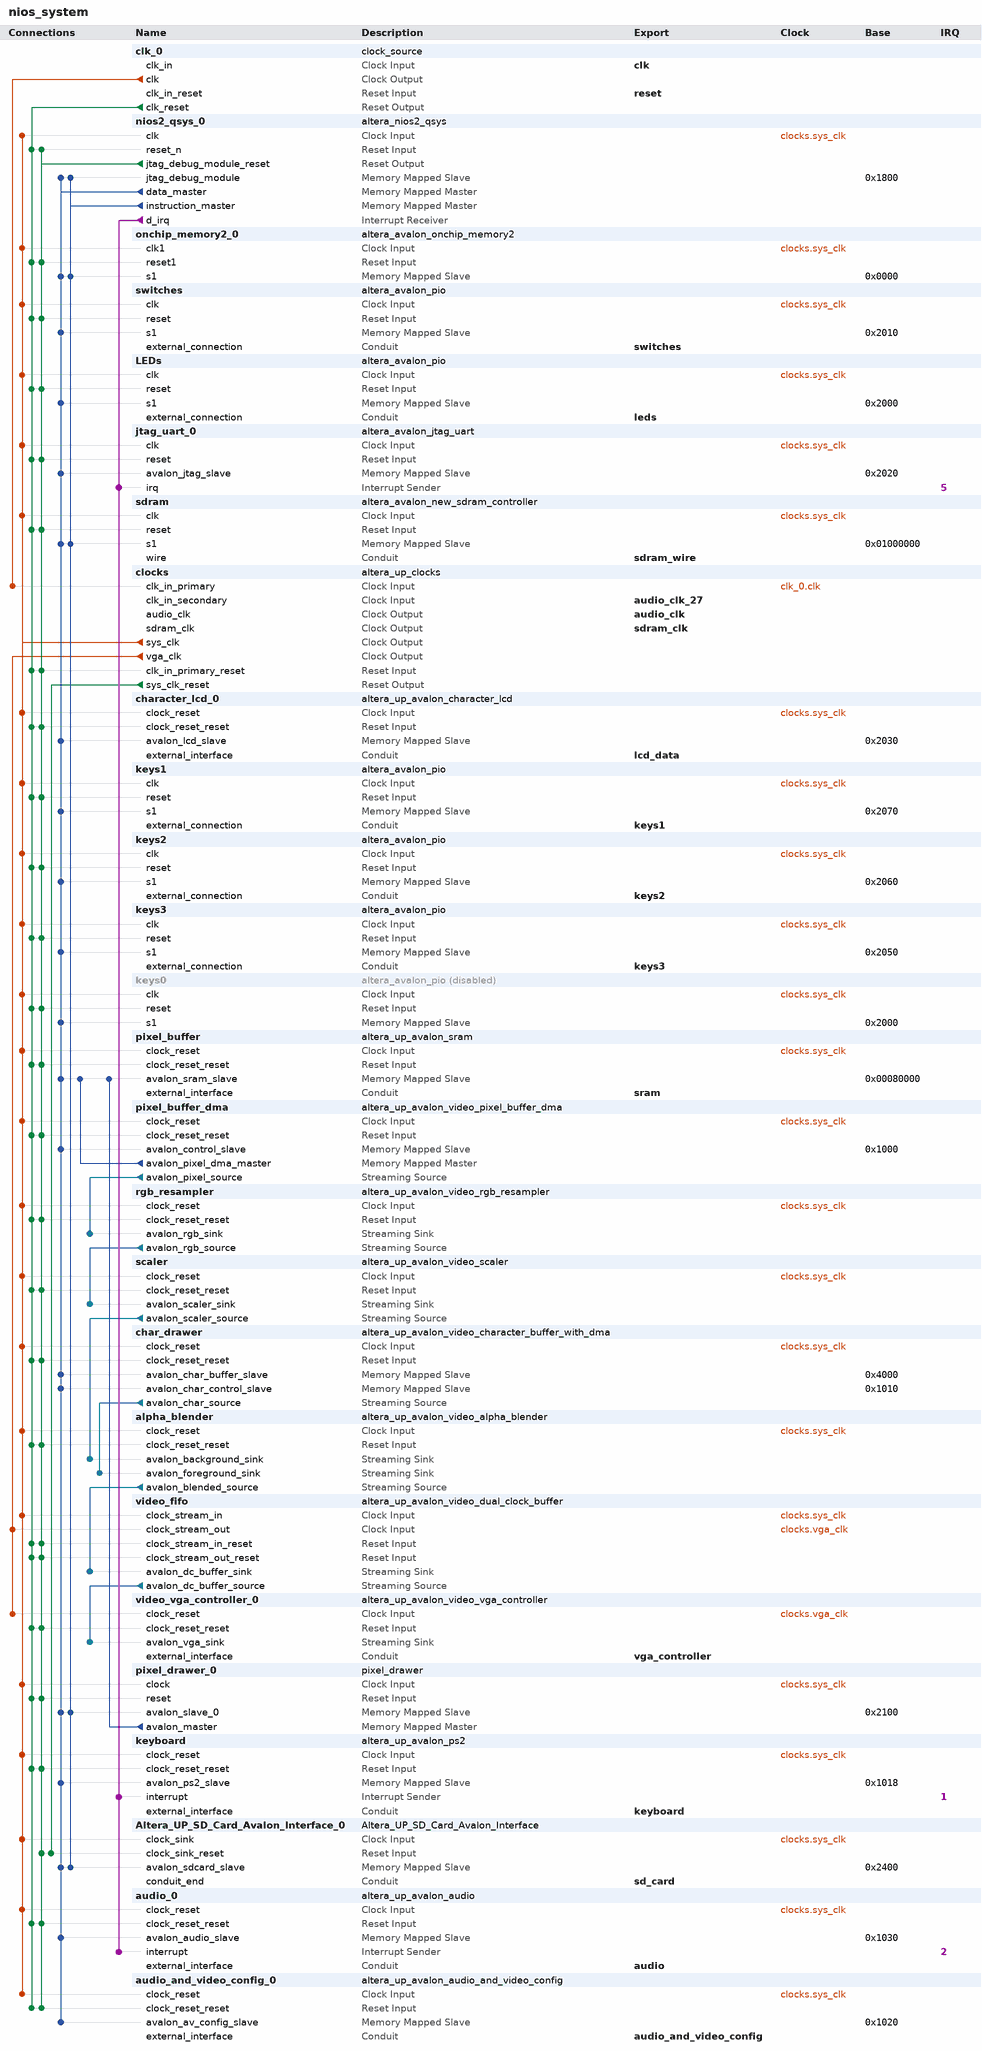
[diagram p0: system contents]
# Platform Designer (Qsys) system nios_system, Cyclone II EP2C35F672C6
# Parameters at their usual value, and those the tool derives, are not listed.
package require -exact qsys 13.0
create_system nios_system
set_project_property DEVICE_FAMILY {Cyclone II}
set_project_property DEVICE EP2C35F672C6

add_instance clk_0 clock_source 13.0
set_instance_parameter_value clk_0 clockFrequency 50000000

add_instance nios2_qsys_0 altera_nios2_qsys 13.0
set_instance_parameter_value nios2_qsys_0 resetSlave sdram.s1
set_instance_parameter_value nios2_qsys_0 mmu_TLBMissExcSlave None
set_instance_parameter_value nios2_qsys_0 exceptionSlave sdram.s1
set_instance_parameter_value nios2_qsys_0 breakSlave nios2_qsys_0.jtag_debug_module
set_instance_parameter_value nios2_qsys_0 impl Fast
set_instance_parameter_value nios2_qsys_0 icache_size 4096

add_instance onchip_memory2_0 altera_avalon_onchip_memory2 13.0.1.99.2
set_instance_parameter_value onchip_memory2_0 dataWidth 32
set_instance_parameter_value onchip_memory2_0 dualPort false
set_instance_parameter_value onchip_memory2_0 initMemContent true
set_instance_parameter_value onchip_memory2_0 initializationFileName onchip_mem.hex
set_instance_parameter_value onchip_memory2_0 memorySize 4096

add_instance switches altera_avalon_pio 13.0.1.99.2
set_instance_parameter_value switches direction Input
set_instance_parameter_value switches width 8

add_instance LEDs altera_avalon_pio 13.0.1.99.2
set_instance_parameter_value LEDs direction Output
set_instance_parameter_value LEDs width 8

add_instance jtag_uart_0 altera_avalon_jtag_uart 13.0.1.99.2
set_instance_parameter_value jtag_uart_0 simInteractiveOptions NO_INTERACTIVE_WINDOWS

add_instance sdram altera_avalon_new_sdram_controller 13.0.1.99.2
set_instance_parameter_value sdram TAC 5.5
set_instance_parameter_value sdram TRCD 20.0
set_instance_parameter_value sdram TRP 20.0
set_instance_parameter_value sdram casLatency 3
set_instance_parameter_value sdram columnWidth 8
set_instance_parameter_value sdram dataWidth 16
set_instance_parameter_value sdram generateSimulationModel false
set_instance_parameter_value sdram model single_Micron_MT48LC4M32B2_7_chip
set_instance_parameter_value sdram numberOfBanks 4
set_instance_parameter_value sdram numberOfChipSelects 1
set_instance_parameter_value sdram powerUpDelay 100.0
set_instance_parameter_value sdram refreshPeriod 15.625
set_instance_parameter_value sdram rowWidth 12

add_instance clocks altera_up_clocks 13.0
set_instance_parameter_value clocks board DE2
set_instance_parameter_value clocks vga_clk true
set_instance_parameter_value clocks audio_clk true
set_instance_parameter_value clocks audio_clk_freq 12.288

add_instance character_lcd_0 altera_up_avalon_character_lcd 13.0
set_instance_parameter_value character_lcd_0 cursor Normal

add_instance keys1 altera_avalon_pio 13.0.1.99.2
set_instance_parameter_value keys1 direction Input
set_instance_parameter_value keys1 width 1

add_instance keys2 altera_avalon_pio 13.0.1.99.2
set_instance_parameter_value keys2 direction Input
set_instance_parameter_value keys2 width 1

add_instance keys3 altera_avalon_pio 13.0.1.99.2
set_instance_parameter_value keys3 direction Input
set_instance_parameter_value keys3 width 1

add_instance keys0 altera_avalon_pio 13.0.1.99.2
set_instance_property keys0 ENABLED false
set_instance_parameter_value keys0 direction Input
set_instance_parameter_value keys0 width 1

add_instance pixel_buffer altera_up_avalon_sram 13.0
set_instance_parameter_value pixel_buffer board DE2
set_instance_parameter_value pixel_buffer pixel_buffer true

add_instance pixel_buffer_dma altera_up_avalon_video_pixel_buffer_dma 13.0
set_instance_parameter_value pixel_buffer_dma addr_mode X-Y
set_instance_parameter_value pixel_buffer_dma start_address 0
set_instance_parameter_value pixel_buffer_dma back_start_address 0
set_instance_parameter_value pixel_buffer_dma image_width 320
set_instance_parameter_value pixel_buffer_dma image_height 240
set_instance_parameter_value pixel_buffer_dma color_space {16-bit RGB}

add_instance rgb_resampler altera_up_avalon_video_rgb_resampler 13.0
set_instance_parameter_value rgb_resampler input_type {16-bit RGB}
set_instance_parameter_value rgb_resampler output_type {30-bit RGB}
set_instance_parameter_value rgb_resampler alpha 1023

add_instance scaler altera_up_avalon_video_scaler 13.0
set_instance_parameter_value scaler width_scaling 2
set_instance_parameter_value scaler height_scaling 2
set_instance_parameter_value scaler width_in 320
set_instance_parameter_value scaler color_bits 10
set_instance_parameter_value scaler color_planes 3

add_instance char_drawer altera_up_avalon_video_character_buffer_with_dma 13.0
set_instance_parameter_value char_drawer enable_transparency true

add_instance alpha_blender altera_up_avalon_video_alpha_blender 13.0

add_instance video_fifo altera_up_avalon_video_dual_clock_buffer 13.0
set_instance_parameter_value video_fifo color_bits 10

add_instance video_vga_controller_0 altera_up_avalon_video_vga_controller 13.0
set_instance_parameter_value video_vga_controller_0 board DE2

add_instance pixel_drawer_0 pixel_drawer 1.0
set_instance_parameter_value pixel_drawer_0 pixel_buffer_base 32768

add_instance keyboard altera_up_avalon_ps2 13.0

add_instance Altera_UP_SD_Card_Avalon_Interface_0 Altera_UP_SD_Card_Avalon_Interface 13.0

add_instance audio_0 altera_up_avalon_audio 13.0
set_instance_parameter_value audio_0 avalon_bus_type {Memory Mapped}
set_instance_parameter_value audio_0 audio_in true
set_instance_parameter_value audio_0 dw 16

add_instance audio_and_video_config_0 altera_up_avalon_audio_and_video_config 13.0
set_instance_parameter_value audio_and_video_config_0 board DE2
set_instance_parameter_value audio_and_video_config_0 audio_in {Microphone to ADC}
set_instance_parameter_value audio_and_video_config_0 line_in_bypass false
set_instance_parameter_value audio_and_video_config_0 bit_length 16
set_instance_parameter_value audio_and_video_config_0 sampling_rate {32 kHz}

# connections
add_connection clk_0.clk clocks.clk_in_primary clock
add_connection clocks.sys_clk alpha_blender.clock_reset clock
add_connection clocks.sys_clk Altera_UP_SD_Card_Avalon_Interface_0.clock_sink clock
add_connection clocks.sys_clk audio_0.clock_reset clock
add_connection clocks.sys_clk audio_and_video_config_0.clock_reset clock
add_connection clocks.sys_clk char_drawer.clock_reset clock
add_connection clocks.sys_clk character_lcd_0.clock_reset clock
add_connection clocks.sys_clk jtag_uart_0.clk clock
add_connection clocks.sys_clk keyboard.clock_reset clock
add_connection clocks.sys_clk keys0.clk clock
add_connection clocks.sys_clk keys1.clk clock
add_connection clocks.sys_clk keys2.clk clock
add_connection clocks.sys_clk keys3.clk clock
add_connection clocks.sys_clk LEDs.clk clock
add_connection clocks.sys_clk nios2_qsys_0.clk clock
add_connection clocks.sys_clk onchip_memory2_0.clk1 clock
add_connection clocks.sys_clk pixel_buffer.clock_reset clock
add_connection clocks.sys_clk pixel_buffer_dma.clock_reset clock
add_connection clocks.sys_clk pixel_drawer_0.clock clock
add_connection clocks.sys_clk rgb_resampler.clock_reset clock
add_connection clocks.sys_clk scaler.clock_reset clock
add_connection clocks.sys_clk sdram.clk clock
add_connection clocks.sys_clk switches.clk clock
add_connection clocks.sys_clk video_fifo.clock_stream_in clock
add_connection clocks.vga_clk video_fifo.clock_stream_out clock
add_connection clocks.vga_clk video_vga_controller_0.clock_reset clock
add_connection clk_0.clk_reset alpha_blender.clock_reset_reset reset
add_connection clk_0.clk_reset audio_0.clock_reset_reset reset
add_connection clk_0.clk_reset audio_and_video_config_0.clock_reset_reset reset
add_connection clk_0.clk_reset char_drawer.clock_reset_reset reset
add_connection clk_0.clk_reset character_lcd_0.clock_reset_reset reset
add_connection clk_0.clk_reset clocks.clk_in_primary_reset reset
add_connection clk_0.clk_reset jtag_uart_0.reset reset
add_connection clk_0.clk_reset keyboard.clock_reset_reset reset
add_connection clk_0.clk_reset keys0.reset reset
add_connection clk_0.clk_reset keys1.reset reset
add_connection clk_0.clk_reset keys2.reset reset
add_connection clk_0.clk_reset keys3.reset reset
add_connection clk_0.clk_reset LEDs.reset reset
add_connection clk_0.clk_reset nios2_qsys_0.reset_n reset
add_connection clk_0.clk_reset onchip_memory2_0.reset1 reset
add_connection clk_0.clk_reset pixel_buffer.clock_reset_reset reset
add_connection clk_0.clk_reset pixel_buffer_dma.clock_reset_reset reset
add_connection clk_0.clk_reset pixel_drawer_0.reset reset
add_connection clk_0.clk_reset rgb_resampler.clock_reset_reset reset
add_connection clk_0.clk_reset scaler.clock_reset_reset reset
add_connection clk_0.clk_reset sdram.reset reset
add_connection clk_0.clk_reset switches.reset reset
add_connection clk_0.clk_reset video_fifo.clock_stream_in_reset reset
add_connection clk_0.clk_reset video_fifo.clock_stream_out_reset reset
add_connection clk_0.clk_reset video_vga_controller_0.clock_reset_reset reset
add_connection clocks.sys_clk_reset Altera_UP_SD_Card_Avalon_Interface_0.clock_sink_reset reset
add_connection nios2_qsys_0.jtag_debug_module_reset alpha_blender.clock_reset_reset reset
add_connection nios2_qsys_0.jtag_debug_module_reset Altera_UP_SD_Card_Avalon_Interface_0.clock_sink_reset reset
add_connection nios2_qsys_0.jtag_debug_module_reset audio_0.clock_reset_reset reset
add_connection nios2_qsys_0.jtag_debug_module_reset audio_and_video_config_0.clock_reset_reset reset
add_connection nios2_qsys_0.jtag_debug_module_reset char_drawer.clock_reset_reset reset
add_connection nios2_qsys_0.jtag_debug_module_reset character_lcd_0.clock_reset_reset reset
add_connection nios2_qsys_0.jtag_debug_module_reset clocks.clk_in_primary_reset reset
add_connection nios2_qsys_0.jtag_debug_module_reset jtag_uart_0.reset reset
add_connection nios2_qsys_0.jtag_debug_module_reset keyboard.clock_reset_reset reset
add_connection nios2_qsys_0.jtag_debug_module_reset keys0.reset reset
add_connection nios2_qsys_0.jtag_debug_module_reset keys1.reset reset
add_connection nios2_qsys_0.jtag_debug_module_reset keys2.reset reset
add_connection nios2_qsys_0.jtag_debug_module_reset keys3.reset reset
add_connection nios2_qsys_0.jtag_debug_module_reset LEDs.reset reset
add_connection nios2_qsys_0.jtag_debug_module_reset nios2_qsys_0.reset_n reset
add_connection nios2_qsys_0.jtag_debug_module_reset onchip_memory2_0.reset1 reset
add_connection nios2_qsys_0.jtag_debug_module_reset pixel_buffer.clock_reset_reset reset
add_connection nios2_qsys_0.jtag_debug_module_reset pixel_buffer_dma.clock_reset_reset reset
add_connection nios2_qsys_0.jtag_debug_module_reset pixel_drawer_0.reset reset
add_connection nios2_qsys_0.jtag_debug_module_reset rgb_resampler.clock_reset_reset reset
add_connection nios2_qsys_0.jtag_debug_module_reset scaler.clock_reset_reset reset
add_connection nios2_qsys_0.jtag_debug_module_reset sdram.reset reset
add_connection nios2_qsys_0.jtag_debug_module_reset switches.reset reset
add_connection nios2_qsys_0.jtag_debug_module_reset video_fifo.clock_stream_in_reset reset
add_connection nios2_qsys_0.jtag_debug_module_reset video_fifo.clock_stream_out_reset reset
add_connection nios2_qsys_0.jtag_debug_module_reset video_vga_controller_0.clock_reset_reset reset
add_connection nios2_qsys_0.data_master Altera_UP_SD_Card_Avalon_Interface_0.avalon_sdcard_slave avalon
set_connection_parameter_value nios2_qsys_0.data_master/Altera_UP_SD_Card_Avalon_Interface_0.avalon_sdcard_slave baseAddress 0x2400
add_connection nios2_qsys_0.data_master audio_0.avalon_audio_slave avalon
set_connection_parameter_value nios2_qsys_0.data_master/audio_0.avalon_audio_slave baseAddress 0x1030
add_connection nios2_qsys_0.data_master audio_and_video_config_0.avalon_av_config_slave avalon
set_connection_parameter_value nios2_qsys_0.data_master/audio_and_video_config_0.avalon_av_config_slave baseAddress 0x1020
add_connection nios2_qsys_0.data_master char_drawer.avalon_char_buffer_slave avalon
set_connection_parameter_value nios2_qsys_0.data_master/char_drawer.avalon_char_buffer_slave baseAddress 0x4000
add_connection nios2_qsys_0.data_master char_drawer.avalon_char_control_slave avalon
set_connection_parameter_value nios2_qsys_0.data_master/char_drawer.avalon_char_control_slave baseAddress 0x1010
add_connection nios2_qsys_0.data_master character_lcd_0.avalon_lcd_slave avalon
set_connection_parameter_value nios2_qsys_0.data_master/character_lcd_0.avalon_lcd_slave baseAddress 0x2030
add_connection nios2_qsys_0.data_master jtag_uart_0.avalon_jtag_slave avalon
set_connection_parameter_value nios2_qsys_0.data_master/jtag_uart_0.avalon_jtag_slave baseAddress 0x2020
add_connection nios2_qsys_0.data_master keyboard.avalon_ps2_slave avalon
set_connection_parameter_value nios2_qsys_0.data_master/keyboard.avalon_ps2_slave baseAddress 0x1018
add_connection nios2_qsys_0.data_master keys0.s1 avalon
set_connection_parameter_value nios2_qsys_0.data_master/keys0.s1 baseAddress 0x2000
add_connection nios2_qsys_0.data_master keys1.s1 avalon
set_connection_parameter_value nios2_qsys_0.data_master/keys1.s1 baseAddress 0x2070
add_connection nios2_qsys_0.data_master keys2.s1 avalon
set_connection_parameter_value nios2_qsys_0.data_master/keys2.s1 baseAddress 0x2060
add_connection nios2_qsys_0.data_master keys3.s1 avalon
set_connection_parameter_value nios2_qsys_0.data_master/keys3.s1 baseAddress 0x2050
add_connection nios2_qsys_0.data_master LEDs.s1 avalon
set_connection_parameter_value nios2_qsys_0.data_master/LEDs.s1 baseAddress 0x2000
add_connection nios2_qsys_0.data_master nios2_qsys_0.jtag_debug_module avalon
set_connection_parameter_value nios2_qsys_0.data_master/nios2_qsys_0.jtag_debug_module baseAddress 0x1800
add_connection nios2_qsys_0.data_master onchip_memory2_0.s1 avalon
set_connection_parameter_value nios2_qsys_0.data_master/onchip_memory2_0.s1 baseAddress 0x0000
add_connection nios2_qsys_0.data_master pixel_buffer.avalon_sram_slave avalon
set_connection_parameter_value nios2_qsys_0.data_master/pixel_buffer.avalon_sram_slave baseAddress 0x00080000
add_connection nios2_qsys_0.data_master pixel_buffer_dma.avalon_control_slave avalon
set_connection_parameter_value nios2_qsys_0.data_master/pixel_buffer_dma.avalon_control_slave baseAddress 0x1000
add_connection nios2_qsys_0.data_master pixel_drawer_0.avalon_slave_0 avalon
set_connection_parameter_value nios2_qsys_0.data_master/pixel_drawer_0.avalon_slave_0 baseAddress 0x2100
add_connection nios2_qsys_0.data_master sdram.s1 avalon
set_connection_parameter_value nios2_qsys_0.data_master/sdram.s1 baseAddress 0x01000000
add_connection nios2_qsys_0.data_master switches.s1 avalon
set_connection_parameter_value nios2_qsys_0.data_master/switches.s1 baseAddress 0x2010
add_connection nios2_qsys_0.instruction_master Altera_UP_SD_Card_Avalon_Interface_0.avalon_sdcard_slave avalon
set_connection_parameter_value nios2_qsys_0.instruction_master/Altera_UP_SD_Card_Avalon_Interface_0.avalon_sdcard_slave baseAddress 0x2400
add_connection nios2_qsys_0.instruction_master nios2_qsys_0.jtag_debug_module avalon
set_connection_parameter_value nios2_qsys_0.instruction_master/nios2_qsys_0.jtag_debug_module baseAddress 0x1800
add_connection nios2_qsys_0.instruction_master onchip_memory2_0.s1 avalon
set_connection_parameter_value nios2_qsys_0.instruction_master/onchip_memory2_0.s1 baseAddress 0x0000
add_connection nios2_qsys_0.instruction_master pixel_drawer_0.avalon_slave_0 avalon
set_connection_parameter_value nios2_qsys_0.instruction_master/pixel_drawer_0.avalon_slave_0 baseAddress 0x2100
add_connection nios2_qsys_0.instruction_master sdram.s1 avalon
set_connection_parameter_value nios2_qsys_0.instruction_master/sdram.s1 baseAddress 0x01000000
add_connection pixel_buffer_dma.avalon_pixel_dma_master pixel_buffer.avalon_sram_slave avalon
set_connection_parameter_value pixel_buffer_dma.avalon_pixel_dma_master/pixel_buffer.avalon_sram_slave baseAddress 0x00080000
add_connection pixel_drawer_0.avalon_master pixel_buffer.avalon_sram_slave avalon
set_connection_parameter_value pixel_drawer_0.avalon_master/pixel_buffer.avalon_sram_slave baseAddress 0x00080000
add_connection alpha_blender.avalon_blended_source video_fifo.avalon_dc_buffer_sink avalon_streaming
add_connection char_drawer.avalon_char_source alpha_blender.avalon_foreground_sink avalon_streaming
add_connection pixel_buffer_dma.avalon_pixel_source rgb_resampler.avalon_rgb_sink avalon_streaming
add_connection rgb_resampler.avalon_rgb_source scaler.avalon_scaler_sink avalon_streaming
add_connection scaler.avalon_scaler_source alpha_blender.avalon_background_sink avalon_streaming
add_connection video_fifo.avalon_dc_buffer_source video_vga_controller_0.avalon_vga_sink avalon_streaming
add_connection nios2_qsys_0.d_irq audio_0.interrupt interrupt
set_connection_parameter_value nios2_qsys_0.d_irq/audio_0.interrupt irqNumber 2
add_connection nios2_qsys_0.d_irq jtag_uart_0.irq interrupt
set_connection_parameter_value nios2_qsys_0.d_irq/jtag_uart_0.irq irqNumber 5
add_connection nios2_qsys_0.d_irq keyboard.interrupt interrupt
set_connection_parameter_value nios2_qsys_0.d_irq/keyboard.interrupt irqNumber 1

# exported interfaces
add_interface clk clock sink
set_interface_property clk EXPORT_OF clk_0.clk_in
add_interface reset reset sink
set_interface_property reset EXPORT_OF clk_0.clk_in_reset
add_interface switches conduit end
set_interface_property switches EXPORT_OF switches.external_connection
add_interface leds conduit end
set_interface_property leds EXPORT_OF LEDs.external_connection
add_interface sdram_wire conduit end
set_interface_property sdram_wire EXPORT_OF sdram.wire
add_interface lcd_data conduit end
set_interface_property lcd_data EXPORT_OF character_lcd_0.external_interface
add_interface keys1 conduit end
set_interface_property keys1 EXPORT_OF keys1.external_connection
add_interface keys2 conduit end
set_interface_property keys2 EXPORT_OF keys2.external_connection
add_interface keys3 conduit end
set_interface_property keys3 EXPORT_OF keys3.external_connection
add_interface sram conduit end
set_interface_property sram EXPORT_OF pixel_buffer.external_interface
add_interface vga_controller conduit end
set_interface_property vga_controller EXPORT_OF video_vga_controller_0.external_interface
add_interface sdram_clk clock source
set_interface_property sdram_clk EXPORT_OF clocks.sdram_clk
add_interface keyboard conduit end
set_interface_property keyboard EXPORT_OF keyboard.external_interface
add_interface sd_card conduit end
set_interface_property sd_card EXPORT_OF Altera_UP_SD_Card_Avalon_Interface_0.conduit_end
add_interface audio conduit end
set_interface_property audio EXPORT_OF audio_0.external_interface
add_interface audio_and_video_config conduit end
set_interface_property audio_and_video_config EXPORT_OF audio_and_video_config_0.external_interface
add_interface audio_clk_27 clock sink
set_interface_property audio_clk_27 EXPORT_OF clocks.clk_in_secondary
add_interface audio_clk clock source
set_interface_property audio_clk EXPORT_OF clocks.audio_clk

set_interconnect_requirement {$system} qsys_mm.clockCrossingAdapter HANDSHAKE
set_interconnect_requirement {$system} qsys_mm.maxAdditionalLatency 1

save_system nios_system.qsys
